# EAGLE design Logging Controller (EAGLE 6.5.0)
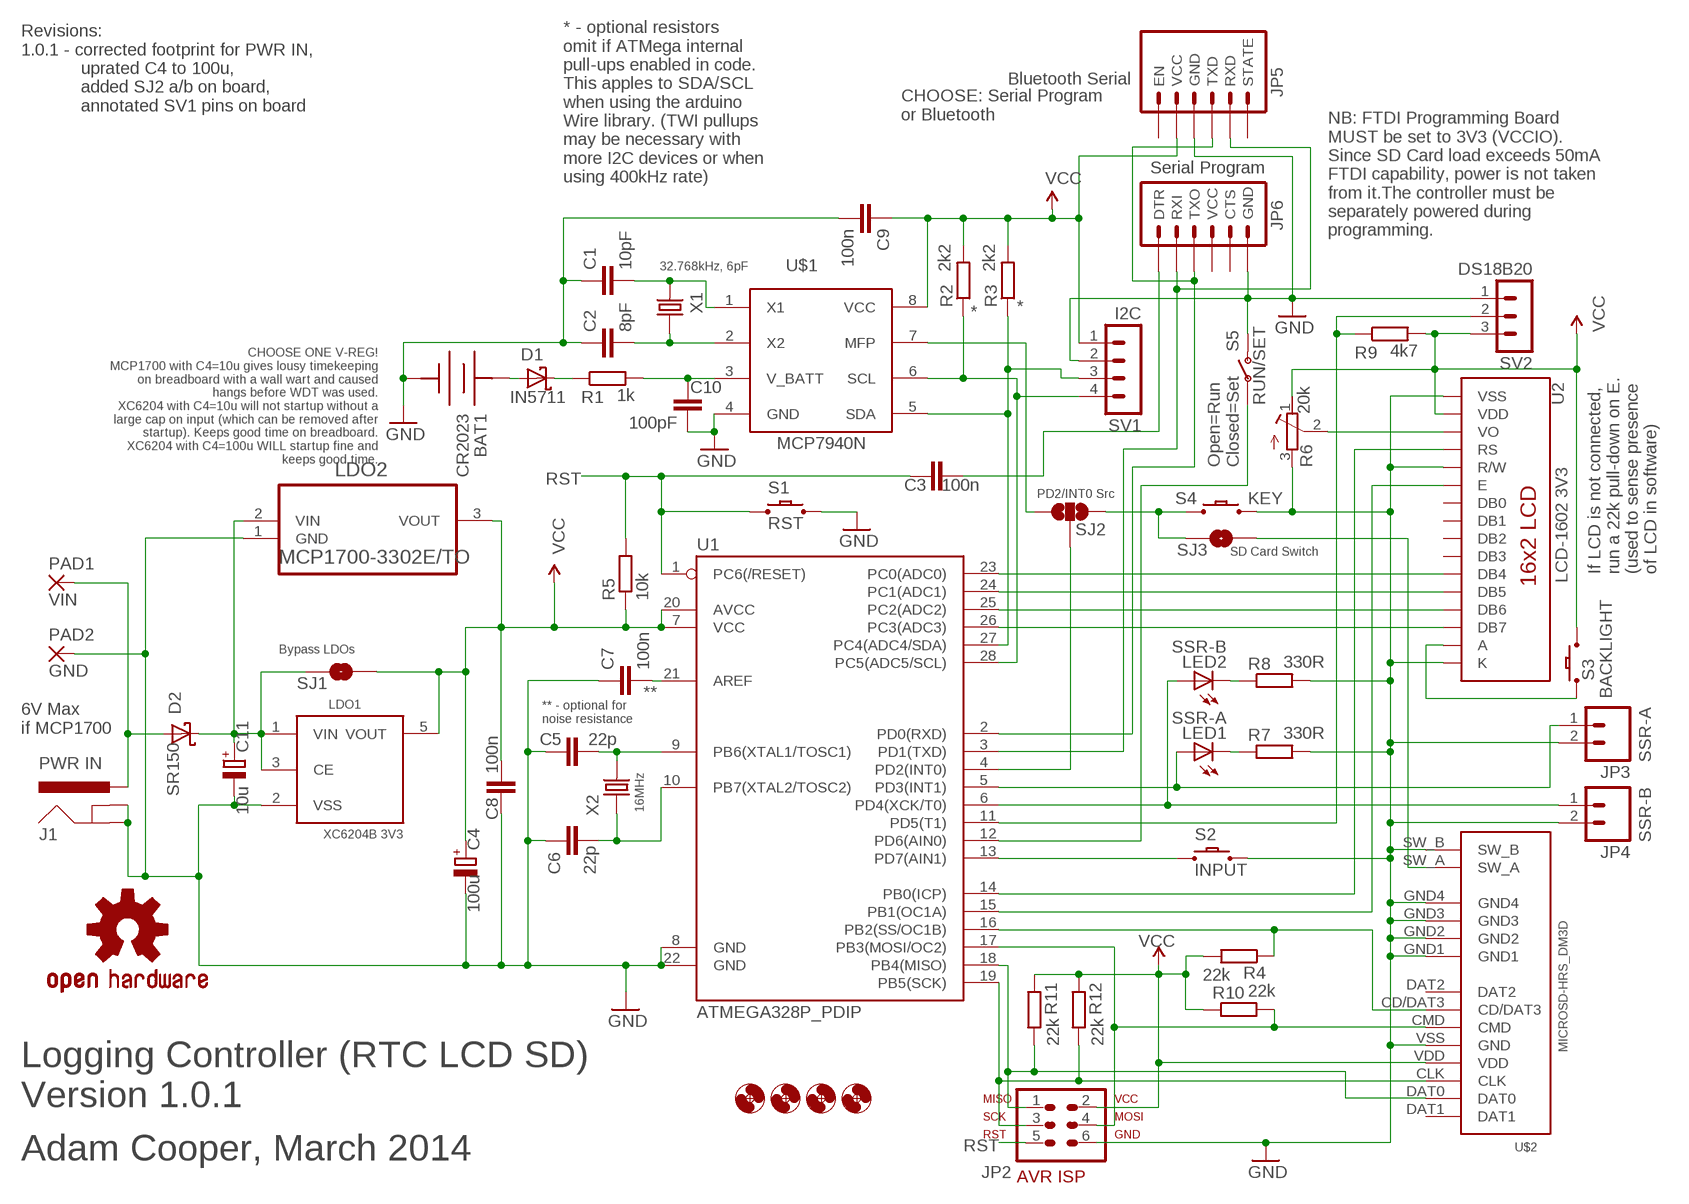
[diagram p0: schematic, sheet 1]

## Parts
BAT1  CR2023  COIN-CELLLIR2450-H  [KEYSTONE3003]
C1  10pF  C-EU025-024X044**100NF+22PF  [C025-024X044]
C2  8pF  C-EU025-024X044**100NF+22PF  [C025-024X044]
C3  100n  C-EU025-024X044**100NF+22PF  [C025-024X044]
C4  100u  CPOL-EUE2.5-5  [E2,5-5]
C5  22p  C-EU025-024X044**100NF+22PF  [C025-024X044]
C6  22p  C-EU025-024X044**100NF+22PF  [C025-024X044]
C7  100n  C-EU025-024X044**100NF+22PF  [C025-024X044]
C8  100n  C-EU025-024X044**100NF+22PF  [C025-024X044]
C9  100n  C-EU025-024X044**100NF+22PF  [C025-024X044]
C10  100pF  C-EU025-024X044**100NF+22PF  [C025-024X044]
C11  10u  CPOL-EUE2.5-5  [E2,5-5]
D1  IN5711  DIODE-SCHOTTKYDO35-7  [DO35-7]
D2  SR150  DIODE-SCHOTTKYDO-41  [DO-41]
H1  MOUNT-HOLE3.0_REDUCED  [3,0]
H2  MOUNT-HOLE3.0_REDUCED  [3,0]
H3  MOUNT-HOLE3.0_REDUCED  [3,0]
H4  MOUNT-HOLE3.0_REDUCED  [3,0]
J1  PWR IN  POWER_JACK**MJ-179PH  [POWER_JACK_SLOT2]
JP2  AVR-ISP  AVR-ISP-6VERT  [AVR-ISP-6]
JP3  SSR-A  M02PTH  [1X02]
JP4  SSR-B  M02PTH  [1X02]
JP5  Bluetooth Serial  BLUETOOTH_SERIAL_MODULEBT_MOD_ROUND  [BT_MOD_ROUND]
JP6  Serial Program  ARDUINO_SERIAL_PROGRAMPTH  [1X06]
LDO1  XC6204B 3V3  XC6204/5  [SOT23-5]
LDO2  MCP1700-3302E/TO  [TO127P254X495-3]
LED1  SSR-A  LED5MM  [LED5MM]
LED2  SSR-B  LED5MM  [LED5MM]
LOGO1  OSHW-LOGOS  [OSHW-LOGO-S]
PAD1  VIN  WIREPAD2,54/1,1  [2,54/1,1]
PAD2  GND  WIREPAD2,54/1,1  [2,54/1,1]
R1  1k  R-EU_0204/7**  [0204/7]
R2  2k2  R-EU_0204/7**  [0204/7]
R3  2k2  R-EU_0204/7**  [0204/7]
R4  22k  R-EU_0204/7**  [0204/7]
R5  10k  R-EU_0204/7**  [0204/7]
R6  20k  R-TRIMMT93YB  [RTRIMT93YB]
R7  330R  R-EU_0204/7**  [0204/7]
R8  330R  R-EU_0204/7**  [0204/7]
R9  4k7  R-EU_0204/7**  [0204/7]
R10  22k  R-EU_0204/7**  [0204/7]
R11  22k  R-EU_0204/7**  [0204/7]
R12  22k  R-EU_0204/7**  [0204/7]
S1  RST  SWITCH-MOMENTARY-2PTH  [TACTILE-PTH]
S2  INPUT  SWITCH-MOMENTARY-2OFF_BOARD_SPST  [OFF_BOARD_SPST]
S3  BACKLIGHT  SWITCH-MOMENTARY-2OFF_BOARD_SPST  [OFF_BOARD_SPST]
S4  KEY  SWITCH-MOMENTARY-2OFF_BOARD_SPST  [OFF_BOARD_SPST]
S5  RUN/SET  SWITCH-SPSTOFFBOARD  [SWITCH-SPST-OFFBOARD]
SJ1  Bypass LDOs  SOLDERJUMPERNO  [SJ_2S-NO]
SJ2  PD2/INT0 Src  SOLDERJUMPER_2WAYS  [SJ_3]
SJ3  SD Card Switch  SOLDERJUMPERNO  [SJ_2S-NO]
SV1  I2C  MA04-1  [MA04-1]
SV2  DS18B20  MA03-1  [MA03-1]
U1  ATMEGA328P_PDIP  [DIL28-3@1]
U2  LCD-1602 3V3  LCD-16X2NOSILK  [LCD-16X2_NOSILK]
U$1  MCP7940N  MCP7940NPDIP  [DIL08]
U$2  MICROSD-HRS_DM3D  [DM3D]
X1  32.768kHz, 6pF  CRYSTAL-TC26H**  [TC26H]
X2  16MHz  CRYSTAL-HC49U-V**16MHZ  [HC49U-V]

## Nets
GND: BAT1.NEG C1.1 C2.1 C4.- C5.1 C6.1 C7.1 C8.1 C9.2 C10.1 C11.- J1.GND J1.GND2(GNDBREAK) JP2.6 JP3.2 JP4.2 JP5.4(GND) JP6.6(GND) LDO1.2(VSS) LDO2.1(GND) PAD2.1(P) R6.3(E) R7.2 R8.2 S1.3 S2.P$2 S4.P$2 S5.1(O) SV1.2 SV2.1 U1.8(GND) U1.22(GND) U2.1(VSS) U2.5(R/W) U2.16(K) U$1.4(GND) U$2.GND1 U$2.GND2 U$2.GND3 U$2.GND4 U$2.SW_B U$2.VSS(GND)
N$1: R9.1 SV2.2 U1.11(PD5(T1))
N$2: R4.1 U1.16(PB2(SS/OC1B)) U$2.CD/DAT3
N$3: U1.14(PB0(ICP)) U2.4(RS)
N$4: U1.15(PB1(OC1A)) U2.6(E)
N$5: U1.23(PC0(ADC0)) U2.11(DB4)
N$6: U1.24(PC1(ADC1)) U2.12(DB5)
N$7: U1.25(PC2(ADC2)) U2.13(DB6)
N$8: U1.26(PC3(ADC3)) U2.14(DB7)
N$9: S3.P$1 U2.15(A)
N$10: S2.P$1 U1.13(PD7(AIN1))
N$11: S5.2(P) U1.12(PD6(AIN0))
N$12: JP4.1 LED2.A U1.6(PD4(XCK/T0))
N$13: JP3.1 LED1.A U1.5(PD3(INT1))
N$14: LED2.K(C) R8.1
N$15: LED1.K(C) R7.1
N$16: S4.P$1 SJ2.3 SJ3.1
N$17: SJ2.2 U1.4(PD2(INT0))
N$18: R6.2(S) U2.3(VO)
N$19: SJ3.2 U$2.SW_A
N$20: SJ2.1 U$1.7(MFP)
N$21: JP5.3(TXD) JP6.3(TXO) U1.2(PD0(RXD))
N$22: JP2.4 R10.2 U1.17(PB3(MOSI/OC2)) U$2.CMD
N$23: JP2.1 R11.2 U1.18(PB4(MISO)) U$2.DAT0
N$26: JP5.2(RXD) JP6.2(RXI) U1.3(PD1(TXD))
N$27: R3.1 SV1.3 U1.27(PC4(ADC4/SDA)) U$1.5(SDA)
N$28: R2.1 SV1.4 U1.28(PC5(ADC5/SCL)) U$1.6(SCL)
N$29: C1.2 U$1.1(X1) X1.2
N$30: C2.2 U$1.2(X2) X1.1
N$31: BAT1.POS BAT1.POS1(POS) D1.A
N$32: D1.C R1.1
N$33: C10.2 R1.2 U$1.3(V_BATT)
N$34: C11.+ D2.C LDO1.1(VIN) LDO1.3(CE) LDO2.2(VIN) SJ1.1
N$36: D2.A J1.POS(PWR) PAD1.1(P)
N$37: C5.2 U1.9(PB6(XTAL1/TOSC1)) X2.2
N$38: C3.2 JP6.1(DTR)
N$39: C6.2 U1.10(PB7(XTAL2/TOSC2)) X2.1
N$41: JP2.3 R12.2 U1.19(PB5(SCK)) U$2.CLK
N$42: C7.2 U1.21(AREF)
RST: C3.1 JP2.5 R5.2 S1.1 U1.1(PC6(/RESET))
VCC: C4.+ C8.2 C9.1 JP2.2 JP5.5(VCC) LDO1.5(VOUT) LDO2.3(VOUT) R2.2 R3.2 R4.2 R5.1 R6.1(A) R9.2 R10.1 R11.1 R12.1 S3.P$2 SJ1.2 SV1.1 SV2.3 U1.7(VCC) U1.20(AVCC) U2.2(VDD) U$1.8(VCC) U$2.VDD
Unconnected: JP5.1(STATE) JP5.6(EN) JP6.4(VCC) JP6.5(CTS) U2.7(DB0) U2.8(DB1) U2.9(DB2) U2.10(DB3) U$2.DAT1 U$2.DAT2

## Notes on the sheet
- Revisions:
  1.0.1 - corrected footprint for PWR IN,
              uprated C4 to 100u,
              added SJ2 a/b on board,
              annotated SV1 pins on board
- CHOOSE: Serial Program 
  or Bluetooth
- * - optional resistors
  omit if ATMega internal
  pull-ups enabled in code.
  This apples to SDA/SCL
  when using the arduino
  Wire library. (TWI pullups
  may be necessary with
  more I2C devices or when
  using 400kHz rate)
- NB: FTDI Programming Board
  MUST be set to 3V3 (VCCIO).
  Since SD Card load exceeds 50mA
  FTDI capability, power is not taken
  from it.The controller must be
  separately powered during
  programming.
- *
- *
- CHOOSE ONE V-REG!
  MCP1700 with C4=10u gives lousy timekeeping
  on breadboard with a wall wart and caused
  hangs before WDT was used.
  XC6204 with C4=10u will not startup without a
  large cap on input (which can be removed after
  startup). Keeps good time on breadboard.
  XC6204 with C4=100u WILL startup fine and
  keeps good time.
- Open=Run
  Closed=Set
- If LCD is not connected,
  run a 22k pull-down on E.
  (used to sense presence
  of LCD in software)
- **
- ** - optional for
  noise resistance
- 6V Max
  if MCP1700
- Logging Controller (RTC LCD SD)
  Version 1.0.1
- Adam Cooper, March 2014

## Library data of the parts
BAT1 = Astronomical Clocks:COIN-CELL: Fabrick.it Coin Cell Holder Coin cell holder for 24.5mm rechargable coin cell
C1-C3 C5-C10 = Astronomical Clocks:C-EU: CAPACITOR, European symbol
C4 C11 = Astronomical Clocks:CPOL-EU: POLARIZED CAPACITOR, European symbol
D1 D2 = Astronomical Clocks:DIODE-SCHOTTKY: DIODE high speed (Philips)
H1-H4 = Logging Controller:MOUNT-HOLE: MOUNTING HOLE with drill center marker
J1 = Astronomical Clocks:POWER_JACK: Power Jack This is the standard 5.5mm barrel jack for power. The PTH is the most common, proven, reliable, footprint. The Slot footprint only works if the mill layer is transmitted to the PCB fab house so be warned. Spark Fun Electronics SKU : PRT-00119 SMT: CONN-08106 Mating wall wart : TOL-00298 (and others)
JP2 = Astronomical Clocks:AVR-ISP-6: AVR ISP-6 Serial Programming Header
JP3 JP4 = Logging Controller:M02: Header 2 Standard 2-pin 0.1" header. Use with straight break away headers (SKU : PRT-00116), right angle break away headers (PRT-00553), swiss pins (PRT-00743), machine pins (PRT-00117), and female headers (PRT-00115). Molex polarized connector foot print use with SKU : PRT-08233 with associated crimp pins and housings.
JP5 = Logging Controller:BLUETOOTH_SERIAL_MODULE: FTDI connector footprints
JP6 = Logging Controller:ARDUINO_SERIAL_PROGRAM: FTDI connector footprints
LDO1 = Astronomical Clocks:XC6204/5
LDO2 = Logging Controller:MCP1700-3302E/TO: IC, Low Quiescent Current LDO,3.3V,TO-92; MPN: MCP1700-3302E/TO; OC_FARNELL: 1296588; OC_NEWARK: 88H9804; PACKAGE: TO-92; SUPPLIER: Microchip
LED1 LED2 = Astronomical Clocks:LED: LEDs Standard schematic elements and footprints for 5mm, 3mm, 1206, and 0603 sized LEDs. 5mm - Spark Fun Electronics SKU : COM-00529 (and others)
LOGO1 = Astronomical Clocks:OSHW-LOGO: Open Source Hardware Logo This logo indicates the piece of hardware it is found on incorporates a OSHW license and/or adheres to the definition of open source hardware found here: http://freedomdefined.org/OSHW
PAD1 PAD2 = Logging Controller:WIREPAD: Wire PAD connect wire on PCB
R1-R5 R7-R12 = Astronomical Clocks:R-EU_: RESISTOR, European symbol
R6 = Logging Controller:R-TRIMM: Trimm resistor
S1-S4 = Logging Controller:SWITCH-MOMENTARY-2: Various NO switches- pushbuttons, reed, etc
S5 = Logging Controller:SWITCH-SPST
SJ1 SJ3 = Astronomical Clocks:SOLDERJUMPER: Solder Jumper Standard SMD solder jumper. Used to automate production. Two varients : Normally Open and Normally Closed are the same, but have different paste layers. NC will have a large amount of paste and should jumper during reflow.
SJ2 = Logging Controller:SOLDERJUMPER_2WAY: Solder Jumper 2 way solder jumper
SV1 = SMD Pads:MA04-1: PIN HEADER; OC_FARNELL: unknown; OC_NEWARK: unknown
SV2 = Logging Controller:MA03-1: PIN HEADER; OC_FARNELL: unknown; OC_NEWARK: unknown
U1 = Astronomical Clocks:ATMEGA328P_PDIP: uC used in the Arduino 32kb flash, 1k EEPROM, 2k SRAM This is the through-hole version of this chip.
U2 = Logging Controller:LCD-16X2: Standard text-only 16x2 parallel input LCD
U$1 = Astronomical Clocks:MCP7940N
U$2 = Logging Controller:MICROSD-HRS_DM3D
X1 X2 = Astronomical Clocks:CRYSTAL*: CRYSTAL

## Board
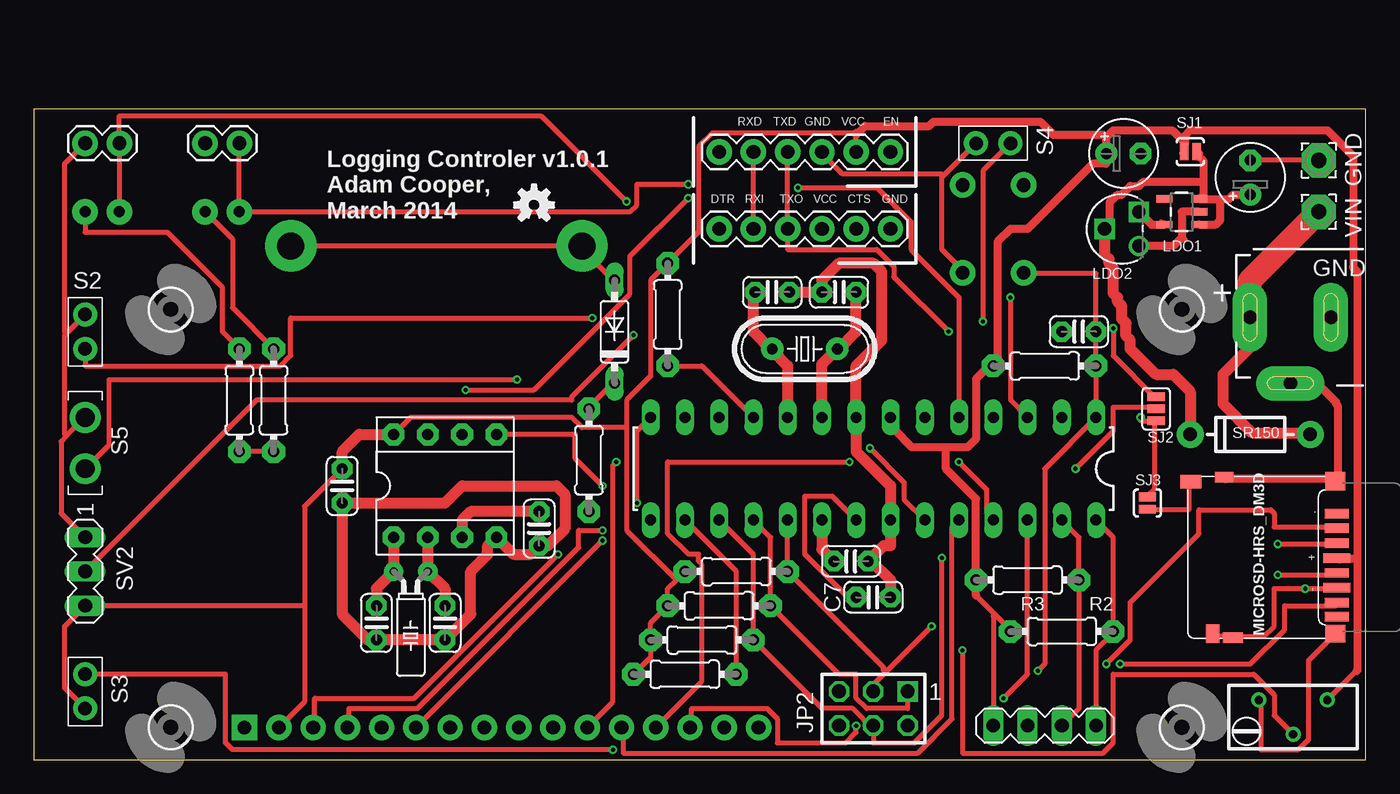
[diagram p1: board, top side]
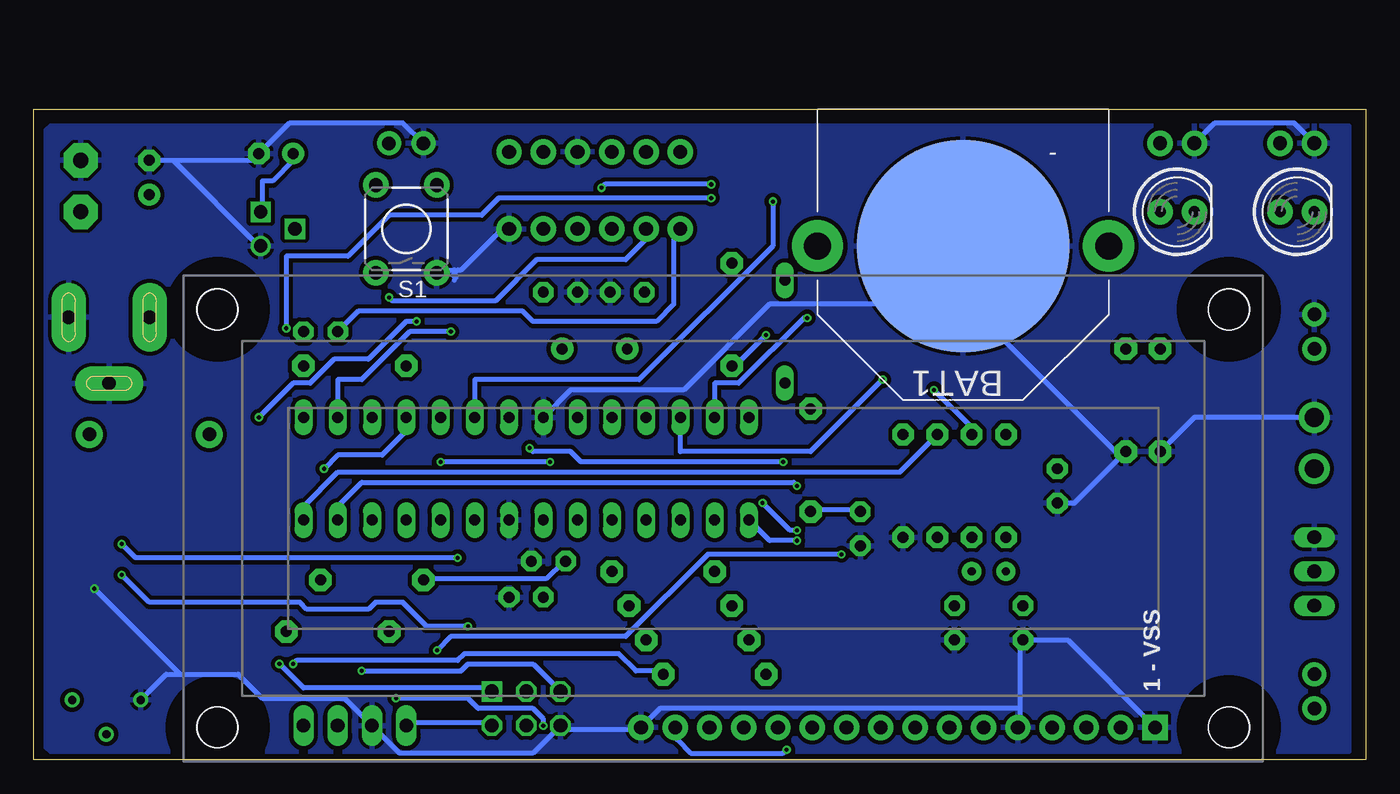
[diagram p2: board, bottom side, seen from below]

Size 98.73 x 48.25 mm. Coordinates in mm from the lower left corner, seen from the top.
Outline: 0,0 98.73,0 98.73,48.25 0,48.25 0,0
Copper layers (1*16): Top 0.035mm / dielectric 1.5mm / Bottom 0.035mm
Design rules "Seeed Fusion_eagle_rule_v1.1 adapted with thick traces and larger clearances AC": minimum track width 15mil, minimum drill 12mil, track to track 8mil, track to pad 8mil, pad to pad 6mil, via to via 6mil, smd to smd 0mil, copper to edge 8mil, drill to drill 10mil, minimum pad ring 10mil, minimum via ring 6mil, stop-mask expansion 2mil, vias tented up to drill 100mil, thermal gap 10mil

### Footprints (pad centres in the part's own frame; a part is rotated, then mirrored left to right if it is on the bottom)
KEYSTONE3003 = smd 15.748 x 15.748: NEG 0,0 | drill 2 pad 3.81: POS -10.795,0; POS1 10.795,0
C025-024X044 = drill 0.813 pad 1.524 octagon: 1 -1.27,0; 2 1.27,0
E2,5-5 = drill 0.813 pad 1.6: + -1.27,0 | drill 0.813 pad 1.6 octagon: - 1.27,0
DO35-7 = drill 0.813 long: A 3.81,0; C -3.81,0
DO-41 = drill 1 pad 1.981: A -4.445,0; C 4.445,0
3,0 = hole 3: 0,0
POWER_JACK_SLOT2 = drill 1 pad 2.54 long: GND 4.88,8; GND2 -0.02,11; POS 4.88,14
AVR-ISP-6 = drill 1.016 square: 1 -2.54,-1.27 | drill 1.016 octagon: 2 -2.54,1.27; 3 0,-1.27; 4 0,1.27; 5 2.54,-1.27; 6 2.54,1.27
1X02 = drill 1.016 pad 1.88: 1 0,0; 2 2.54,0
BT_MOD_ROUND = drill 1.016 pad 1.88: 1 0,0; 2 2.54,0; 3 5.08,0; 4 7.62,0; 5 10.16,0; 6 12.7,0
1X06 = drill 1.016 pad 1.88: 1 0,0; 2 2.54,0; 3 5.08,0; 4 7.62,0; 5 10.16,0; 6 12.7,0
SOT23-5 = smd 0.55 x 1.2: 1 -0.95,-1.3; 2 0,-1.3; 3 0.95,-1.3; 4 0.95,1.3; 5 -0.95,1.3
TO127P254X495-3 = drill 0.991: 1 -2.54,-2.54 | drill 0.991 square: 2 -1.27,0; 3 0,-2.54
LED5MM = drill 0.813 pad 1.88: A -1.27,0; K 1.27,0
2,54/1,1 = drill 1.118 pad 2.54 octagon: 1 0,0
0204/7 = drill 0.813 pad 1.676 octagon: 1 -3.81,0; 2 3.81,0
RTRIMT93YB = drill 0.61: 1 1.27,-2.54; 2 -1.27,0; 3 1.27,2.54
TACTILE-PTH = drill 1.016 pad 1.88: 1 -3.251,2.261; 2 3.251,2.261; 3 -3.251,-2.261; 4 3.251,-2.261
OFF_BOARD_SPST = drill 1 pad 1.778: P$1 -1.27,0; P$2 1.27,0
SWITCH-SPST-OFFBOARD = drill 1.4 pad 2.286: 1 -1.905,0.015; 2 1.905,0
SJ_2S-NO = smd 0.635 x 1.27: 1 -0.45,0; 2 0.45,0
SJ_3 = smd 0.635 x 1.27: 1 -0.889,0; 2 0,0; 3 0.889,0
MA04-1 = drill 1.016 long: 1 -3.81,0; 2 -1.27,0; 3 1.27,0; 4 3.81,0
MA03-1 = drill 1.016 long: 1 -2.54,0; 2 0,0; 3 2.54,0
DIL28-3@1 = drill 0.813 long: 1 -16.51,-3.81; 2 -13.97,-3.81; 3 -11.43,-3.81; 4 -8.89,-3.81; 5 -6.35,-3.81; 6 -3.81,-3.81; 7 -1.27,-3.81; 8 1.27,-3.81; 9 3.81,-3.81; 10 6.35,-3.81; 11 8.89,-3.81; 12 11.43,-3.81; 13 13.97,-3.81; 14 16.51,-3.81; 15 16.51,3.81; 16 13.97,3.81; 17 11.43,3.81; 18 8.89,3.81; 19 6.35,3.81; 20 3.81,3.81; 21 1.27,3.81; 22 -1.27,3.81; 23 -3.81,3.81; 24 -6.35,3.81; 25 -8.89,3.81; 26 -11.43,3.81; 27 -13.97,3.81; 28 -16.51,3.81
LCD-16X2_NOSILK = drill 1.016 pad 1.88 square: 1 -32,15.5 | drill 1.016 pad 1.88: 2 -29.46,15.5; 3 -26.92,15.5; 4 -24.38,15.5; 5 -21.84,15.5; 6 -19.3,15.5; 7 -16.76,15.5; 8 -14.22,15.5; 9 -11.68,15.5; 10 -9.14,15.5; 11 -6.6,15.5; 12 -4.06,15.5; 13 -1.52,15.5; 14 1.02,15.5; 15 3.56,15.5; 16 6.1,15.5
DIL08 = drill 0.813 pad 1.6 octagon: 1 -3.81,-3.81; 2 -1.27,-3.81; 3 1.27,-3.81; 4 3.81,-3.81; 5 3.81,3.81; 6 1.27,3.81; 7 -1.27,3.81; 8 -3.81,3.81
DM3D = smd 0.7 x 1.75: CD/DAT3 8.15,0.45; CLK 4.85,0.45; CMD 7.05,0.45; DAT0 2.65,0.45; DAT1 1.6,0.45; DAT2 9.25,0.45 | smd 0.8 x 1.5: GND1 0.05,8.15 | smd 0.8 x 1.4: GND2 11.95,8.8 | smd 1.4 x 1.5: GND3 11.65,0.55 | smd 1.3 x 1.5: GND4 0.35,0.55 | smd 1 x 1.55: SW_A 11.6,11.25 | smd 1.4 x 1: SW_B 0.35,9.65 | smd 0.7 x 2.032: VDD 5.95,0.45; VSS 3.75,0.45
TC26H = drill 0.6 pad 1.422: 1 -1.27,0; 2 1.27,0
HC49U-V = drill 0.813 pad 1.676: 1 -2.413,0; 2 2.413,0

### Placement (x,y rotation side)
BAT1  29.84,38.1 0 bottom
C1  25.4,10.16 90 top
C2  30.48,10.16 90 top
C3  77.47,31.75 180 top
C4  80.77,44.96 0 top
C5  59.69,34.67 0 top
C6  54.74,34.67 180 top
C7  62.23,12.06 180 top
C8  60.58,14.73 180 top
C9  22.86,20.32 270 top
C10  37.47,17.14 90 top
C11  90.17,43.18 90 top
D1  43.05,31.75 90 top
D2  90.17,24.13 180 top
H1  10.16,2.41 0 top
H2  85.09,33.4 0 top
H3  10.16,33.4 0 top
H4  85.09,2.41 0 top
J1  104.14,27.94 90 top
JP2  62.23,3.81 180 top
JP3  15.24,45.72 180 top
JP4  6.35,45.72 180 top
JP5  50.8,45.09 0 top
JP6  50.8,39.37 0 top
LDO1  85.09,40.64 90 top
LDO2  79.38,40.64 90 top
LED1  13.97,40.64 0 bottom
LED2  5.08,40.64 0 bottom
LOGO1  37.08,41.15 0 top
PAD1  95.25,40.64 90 top
PAD2  95.25,44.45 90 top
R1  41.15,22.23 270 top
R2  76.2,9.53 180 top
R3  73.66,13.34 180 top
R4  48.26,6.35 180 top
R5  74.93,29.21 0 top
R6  93.34,3.17 90 top
R7  17.78,26.67 270 top
R8  15.24,26.67 270 top
R9  46.99,33.02 90 top
R10  49.53,8.89 0 top
R11  50.8,11.43 0 top
R12  52.07,13.97 0 top
S1  71.12,39.37 90 bottom
S2  3.81,31.75 90 top
S3  3.81,5.08 270 top
S4  71.12,45.72 180 top
S5  3.81,23.5 270 top
SJ1  85.72,45.09 180 top
SJ2  83.19,26.04 270 top
SJ3  82.55,19.05 270 top
SV1  74.93,2.54 0 top
SV2  3.81,13.97 270 top
U1  62.23,21.59 180 top
U2  47.62,17.91 180 bottom
U$1  30.48,20.32 0 top
U$2  97.03,9.02 90 top
X1  27.94,13.97 180 top
X2  57.15,30.48 0 top

### Tracks (layer width: path | path; a pad name or v marks a point on that pad's centre or on a via)
GND  (via drill 0.3)
  Top 0.381: U$2.SW_B 87.63,9.14 88.65,9.14 U$2.GND1 88.9,9.14 91.19,9.14 91.95,9.91 91.95,12.7 v94.23,12.7 96.52,12.7 U$2.VSS | 88.39,20.83 U$2.GND2 | 96.27,20.83 U$2.GND3 | U$2.GND4 96.27,9.14 94.49,7.37 94.49,1.52 93.73,0.76 90.93,0.76 90.93,4.32 R6.3 | 67.44,43.31 67.31,43.18 67.31,37.85 68.83,36.32 S1.3 | 67.44,43.31 S4.P$2 | JP5.4 58.42,44.96 59.94,43.43 67.31,43.43 67.44,43.31 | 85.34,38.61 85.09,38.73 | PAD2.1 C11.- | R7.2 R8.2 | SV2.1 2.03,18.29 2.03,23.62 2.41,24 | 2.41,24 3.81,25.4 S5.1 | 2.41,31.62 2.29,31.5 2.29,24.13 2.41,24 | 2.41,31.62 S2.P$2 | JP4.2 2.29,44.2 2.29,31.75 2.41,31.62
  Top 0.61: LDO1.2 85.09,40.64 85.09,38.73 84.45,38.1 LDO2.1 | 96.27,20.83 88.37,20.83 U$2.GND2 | J1.GND2 95.14,27.92 96.52,26.54 96.52,26.42 96.65,26.29 96.65,20.84 U$2.GND3
  Top 0.813: C6.1 C5.1 58.42,35.56 59.69,36.83 62.23,36.83 62.87,36.2 62.87,31.11 60.96,29.21 U1.8 60.96,22.86 63.5,20.32 U1.22 63.5,15.88 62.99,15.88 C8.1 62.1,14.73 63.5,13.34 C7.1 | U$1.4 35.56,15.24 36.83,15.24 C10.1 38.1,15.88 39.37,17.14 39.37,19.68 38.73,20.32 31.75,20.32 30.48,19.05 C9.2 22.86,10.79 24.77,8.89 C1.1 C2.1 32.38,10.79 32.38,13.97 33.66,15.24 33.66,15.88 U$1.4
  Bottom 0.381: 67.56,35.56 67.46,35.76 | 67.46,35.76 67.45,35.78 | 67.44,36.2 67.56,36.07 67.56,35.81 67.46,35.76 | 67.44,36.2 67.41,36.23 67.31,36.32 67.06,36.32 64.01,39.37 JP6.6 | 87.88,6.35 88.9,6.35 R6.3 | 87.88,6.35 83.57,6.35 81.79,4.57 75.69,4.57 SV1.2 71.63,0.51 61.72,0.51 JP2.6 59.69,2.29 53.85,2.29 U2.16 53.59,2.54 52.32,3.81 25.65,3.81 | 87.88,6.35 v94.23,12.7 | 67.44,36.2 67.56,36.32 68.83,36.32 S1.3 | C11.- 88.39,44.45 | 88.39,44.45 82.55,44.45 C4.- 79.76,47.24 71.37,47.24 S4.P$2 | 88.39,44.45 82.04,38.1 LDO2.1 | U1.8 58.93,27.43 50.55,27.43 44.2,33.78 34.29,33.78 29.97,38.1 BAT1.NEG 31.75,36.07 18.29,22.61 R7.2 21.59,19.05 C9.2 | U2.1 15.75,2.54 22.1,8.89 C1.1 25.65,8.89 25.65,3.81 | 25.65,3.81 25.65,2.54 U2.5 | JP4.2 5.33,47.24 11.18,47.24 JP3.2 | R8.2 12.7,25.4 S5.1
  pour Bottom (isolate 0.305): 1.27,46.99 1.27,0.64 97.47,0.64 97.79,0.95 97.79,46.67 97.47,46.99
N$1  (via drill 0.3)
  Top 0.381: U1.11 49.53,29.21 R9.1 | SV2.2 16.51,26.67 39.88,26.67 39.88,26.92 v44.45,31.5
  Bottom 0.381: v44.45,31.5 46.74,29.21 R9.1
N$2  (via drill 0.3)
  Top 0.381: v79.5,7.11 81.28,8.89 81.28,11.68 86.36,16.76 86.36,18.54 91.69,18.54 91.95,18.29 91.95,17.27 96.52,17.27 U$2.CD/DAT3 | U1.16 52.07,13.97 R4.1
  Bottom 0.381: v79.5,7.11 79.25,7.37 67.31,7.37 66.8,7.87 55.37,7.87 54.1,6.6 52.32,6.6 R4.1
N$3  (via drill 0.3)
  Top 0.381: U1.14 44.7,24.38 v44.7,19.05 | v42.16,17.02 40.39,17.02 40.39,15.75 28.45,3.81 23.37,3.81 23.37,2.54 U2.4
  Bottom 0.381: v44.7,19.05 42.67,17.02 v42.16,17.02
N$4  (via drill 0.3)
  Top 0.381: v42.16,16.26 28.45,2.54 U2.6
  Bottom 0.381: U1.15 44.2,16.26 v42.16,16.26
N$5  (via drill 0.3)
  Top 0.381: U1.23 64.52,19.3 64.52,20.57 v61.98,23.11 | v43.18,22.1 42.93,21.84 42.93,4.32 41.15,2.54 U2.11
  Bottom 0.381: v61.98,23.11 61.72,22.86 58.93,22.86 58.17,22.1 v43.18,22.1
N$6
  Top 0.381: U1.24 68.07,17.27 68.07,3.05 65.53,0.51 43.69,0.51 43.69,2.29 U2.12
N$7  (via drill 0.3)
  Top 0.381: U1.25 70.61,18.29 70.61,20.07 v68.58,22.1 | v60.45,22.1 46.99,22.1 46.99,16.76 48.51,15.24 49.28,15.24 49.28,14.73 49.53,14.48 49.53,5.84 46.23,2.54 U2.13
  Bottom 0.381: v60.45,22.1 v68.58,22.1
N$8  (via drill 0.3)
  Top 0.381: U1.26 73.66,6.35 v71.88,4.57 | v60.96,2.54 60.96,2.03 60.2,1.27 55.12,1.27 55.12,3.05 54.36,3.81 48.77,3.81 48.77,2.54 U2.14
  Bottom 0.381: v71.88,4.57 66.55,4.57 65.79,3.81 61.72,3.81 60.96,3.05 v60.96,2.54
N$9  (via drill 0.3)
  Top 0.381: S3.P$1 14.22,6.35 14.22,1.27 14.73,0.76 v42.93,0.76
  Bottom 0.381: v42.93,0.76 43.18,0.51 50.04,0.51 51.05,1.52 51.05,2.29 U2.15
N$10  (via drill 0.3)
  Top 0.381: v41.4,32.77 19.05,32.77 19.05,29.97 18.29,29.21 3.81,29.21 S2.P$1
  Bottom 0.381: U1.13 48.26,27.94 46.48,27.94 41.66,32.77 v41.4,32.77
N$11  (via drill 0.3)
  Top 0.381: v35.81,28.19 5.59,28.19 5.59,23.37 S5.2
  Bottom 0.381: U1.12 50.8,22.86 41.15,22.86 v35.81,28.19
N$12  (via drill 0.3)
  Top 0.381: v43.94,41.4 37.59,47.75 6.35,47.75 JP4.1 LED2.A
  Bottom 0.381: U1.6 66.04,28.19 53.85,28.19 43.94,38.1 v43.94,41.4
N$13  (via drill 0.3)
  Top 0.381: U1.5 68.58,34.29 65.02,37.85 65.02,39.88 62.48,42.42 v56.64,42.42 | v48.51,42.67 44.7,42.67 44.7,41.15 44.2,40.64 LED1.A JP3.1
  Bottom 0.381: v56.64,42.42 56.39,42.67 v48.51,42.67
N$14
  Top 0.381: R8.1 13.97,31.75 13.97,35.05 9.91,39.12 3.81,39.12 LED2.K
N$15
  Top 0.381: R7.1 14.73,33.53 14.73,38.61 LED1.K
N$16  (via drill 0.3)
  Top 0.381: 83.06,25.15 83.06,20.07 82.55,19.56 SJ3.1 | 83.06,25.15 82.04,25.15 v82.04,25.4 | v70.36,32.51 70.36,43.69 S4.P$1 | 83.06,25.15 SJ2.3
  Bottom 0.381: v82.04,25.4 79.5,27.94 78.23,27.94 76.45,29.72 73.91,29.72 71.12,32.51 v70.36,32.51
N$17  (via drill 0.3)
  Top 0.381: v77.22,21.59 80.01,24.38 80.01,26.16 83.06,26.16 SJ2.2
  Bottom 0.381: v77.22,21.59 76.2,22.61 72.9,22.61 71.12,24.38 U1.4
N$18  (via drill 0.3)
  Top 0.381: R6.2 91.95,3.3 91.95,4.83 90.42,6.35 80.01,6.35 80.01,1.27 79.25,0.51 68.83,0.51 v68.83,8.13 | v38.86,15.24 28.19,4.57 20.83,4.57 20.83,2.54 U2.3
  Bottom 0.381: v68.83,8.13 67.82,9.14 54.86,9.14 48.77,15.24 v38.86,15.24
N$19
  Top 0.381: SJ3.2 82.55,18.54 85.6,18.54 85.6,20.57 U$2.SW_A
N$20  (via drill 0.3)
  Top 0.381: v80.01,32 80.01,29.97 83.06,26.92 SJ2.1 | v48.51,41.66 44.2,37.34 44.2,34.54 37.08,27.43 v32,27.43
  Bottom 0.381: v80.01,32 80.01,37.34 75.44,37.34 72.39,40.39 65.53,40.39 64.26,41.66 v48.51,41.66 | v32,27.43 29.21,24.64 U$1.7
N$21  (via drill 0.3)
  Top 0.381: v67.82,31.75 63.75,35.81 63.75,36.58 62.48,37.85 55.88,37.85 JP6.3 JP5.3
  Bottom 0.381: U1.2 76.2,28.19 74.42,28.19 70.87,31.75 v67.82,31.75
N$22  (via drill 0.3)
  Top 0.381: U1.17 53.34,15.24 R10.2 58.42,3.81 60.71,3.81 62.23,2.29 | v92.2,16 96.52,16 U$2.CMD | v67.31,14.99 67.31,3.3 65.28,1.27 62.23,1.27 62.23,2.29 | 62.23,2.29 JP2.4
  Bottom 0.381: v92.2,16 91.19,14.99 v67.31,14.99
N$23  (via drill 0.3)
  Top 0.381: U1.18 54.61,16.51 R11.2 59.69,6.35 60.96,6.35 60.96,4.57 61.72,3.81 64.77,3.81 JP2.1 | v80.52,7.11 90.17,7.11 92.71,9.65 92.71,11.43 96.52,11.43 U$2.DAT0
  Bottom 0.381: v80.52,7.11 78.74,5.33 65.02,5.33 JP2.1
N$26  (via drill 0.3)
  Top 0.381: U1.3 72.39,26.67 v72.39,34.29 | JP6.2 JP5.2
  Bottom 0.381: v72.39,34.29 72.14,34.04 64.52,34.04 61.47,37.08 54.86,37.08 53.34,38.61 JP6.2
N$27  (via drill 0.3)
  Top 0.381: U1.27 77.47,16.51 R3.1 77.47,3.81 SV1.3 | U$1.5 40.13,24.13 40.13,22.35 v42.16,20.32
  Bottom 0.381: v42.16,20.32 42.42,20.57 74.42,20.57 76.2,18.8 U1.27
N$28
  Top 0.381: U1.28 80.01,16.51 R2.1 80.01,9.4 78.74,8.13 SV1.4
  Bottom 0.381: U$1.6 34.54,21.34 76.2,21.34 78.74,18.8 U1.28
N$29
  Top 0.813: U$1.1 X1.2 25.4,12.7 C1.2
N$30
  Top 0.813: U$1.2 X1.1 30.48,12.7 C2.2
N$31
  Top 0.381: D1.A 42.93,35.56 40.64,37.85 BAT1.POS BAT1.POS1
N$32
  Top 0.381: D1.C 42.93,27.94 41.15,26.16 R1.1
N$33
  Top 0.813: C10.2 32.38,18.41 31.75,17.78 U$1.3
  Bottom 0.381: R1.2 41.15,18.54 37.59,18.54 C10.2
N$34
  Top 0.381: 86.36,44.96 SJ1.1 | 86.36,41.66 LDO1.3 | 79.5,39.37 LDO2.2 79.76,39.37
  Top 0.61: 87.95,41.59 LDO1.3 86.68,41.88 86.68,42.86 | 87.95,41.59 88.58,41.59 88.9,41.91 C11.+ | LDO1.1 87.63,39.69 87.95,40.01 87.95,41.59 | 86.36,44.96 86.36,44.77 86.68,44.45 86.68,42.86 | 79.76,39.37 79.76,41.34 80.33,41.91 80.64,41.91 81.28,42.55 81.92,42.55 82.23,42.86 86.68,42.86
  Top 0.813: LDO2.2 79.38,37.47 79.69,37.15 79.69,36.83 80.01,36.51 80.01,34.61 80.33,34.29 80.33,33.97 80.64,33.66 80.64,32.7 80.96,32.38 80.96,31.43 81.28,31.11 81.28,30.48 83.19,28.57 84.45,28.57 85.72,27.3 D2.C
N$36
  Top 0.813: J1.POS 90.14,30.58 88.14,28.57 88.14,26.42 90.3,24.26 94.49,24.26 D2.A
  Top 1.778: J1.POS 90.14,35.53 PAD1.1
N$37
  Top 0.813: C5.2 60.96,31.75 59.69,30.48 X2.2 58.42,29.34 U1.9
N$38
  Bottom 0.381: C3.2 74.68,33.27 62.48,33.27 61.72,32.51 52.58,32.51 51.31,33.78 51.31,39.37 JP6.1
N$39
  Top 0.813: C6.2 53.34,34.54 53.34,31.75 54.61,30.48 X2.1 54.74,30.35 55.88,29.21 U1.10
N$41  (via drill 0.3)
  Top 0.381: U1.19 R12.2 62.99,6.86 62.99,6.6 63.12,6.48 | v92.2,13.72 96.52,13.72 U$2.CLK | 63.12,6.48 62.23,5.59 JP2.3 | 63.12,6.48 v66.55,9.91
  Bottom 0.381: v92.2,13.72 90.17,11.68 78.99,11.68 78.49,11.18 73.91,11.18 73.41,11.68 71.37,11.68 69.6,9.91 v66.55,9.91
N$42
  Top 0.381: U1.21 59.18,19.56 57.15,19.56 57.15,15.24 60.2,12.19 60.96,12.19 C7.2
RST  (via drill 0.3)
  Top 0.381: v74.42,6.6 74.93,7.11 74.93,21.59 U1.1 R5.2 C3.1 78.74,36.07 73.41,36.07 S1.1
  Bottom 0.381: JP2.5 61.72,7.11 66.55,7.11 67.06,6.6 v74.42,6.6
VCC
  Top 0.381: 71.25,10.79 69.85,12.19 R3.2 | 71.25,10.79 72.39,9.65 R2.2 | 59.69,14.73 C8.2 | SV1.1 71.12,10.67 71.25,10.79 | R6.1 98.04,6.6 | 96.77,14.73 U$2.VDD 96.77,14.99 97.28,14.99 97.47,14.92 | 83.57,39.88 LDO1.5 | 85.09,44.96 SJ1.2 85.34,45.21 85.34,45.72 | 71.63,29.72 R5.1 | 79.5,44.2 C4.+ | S3.P$2 2.29,5.33 2.29,9.91 SV2.3 20.07,11.43 | 20.07,11.43 20.07,18.8 C9.1 | 20.07,11.43 20.07,4.32 18.29,2.54 U2.2 | R4.2 45.72,7.62 R10.1 45.72,10.16 R11.1 46.99,12.7 47.62,13.34 | 47.62,13.34 R12.1 | 60.96,46.48 50.29,46.48 49.28,45.47 49.28,39.12 R9.2 45.72,35.56 45.72,28.45 43.94,26.67 43.94,24.64 | JP5.5 60.96,46.35 | 47.62,13.34 43.94,17.02 43.94,24.64 | U$1.8 27.94,25.4 39.88,25.4 40.64,24.64 43.94,24.64 | 82.04,40.64 LDO2.3
  Top 0.61: 79.5,46.16 79.5,44.2 78.49,44.2 73.66,39.37 72.39,39.37 71.44,38.42 71.44,29.53 R5.1 70.8,29.21 69.85,28.26 69.85,23.81 69.22,23.18 67.63,23.18 | 79.5,46.16 80.01,46.67 84.39,46.67 85.34,45.72 85.34,46.29 85.72,46.67 95.89,46.67 97.79,44.77 97.79,36.51 98.11,36.2 98.11,14.92 | 82.04,40.64 82.04,40.51 82.87,39.69 LDO1.5 | 60.96,46.48 60.96,46.35 61.59,46.99 66.36,46.99 66.67,47.31 74.61,47.31 75.56,46.35 79.31,46.35 79.5,46.16 | 67.63,23.18 65.09,23.18 63.82,24.45 63.82,25.08 U1.7 | 69.85,12.19 69.85,19.37 67.63,21.59 67.63,23.18 | 97.47,14.92 98.11,14.92 | 98.11,14.92 98.11,6.67 98.04,6.6
  Top 0.813: U1.20 58.42,15.62 C8.2 | C9.1 22.86,22.86 24.13,24.13 U$1.8
  Bottom 0.381: JP2.2 65.02,2.79 70.87,2.79 SV1.1 | C4.+ 79.5,44.45 81.03,42.93 81.79,42.93 81.79,40.64 LDO2.3 | C8.2 59.44,14.73 60.71,13.46 69.85,13.46 R3.2

### Text on the board
tPlace: Logging Controler v1.0.1 / Adam Cooper, / March 2014
bPlace: 1 - VSS
tValues: a | a | SCL | +ve | GND | SDA